# EAGLE schematic final (EAGLE 8.4.1)
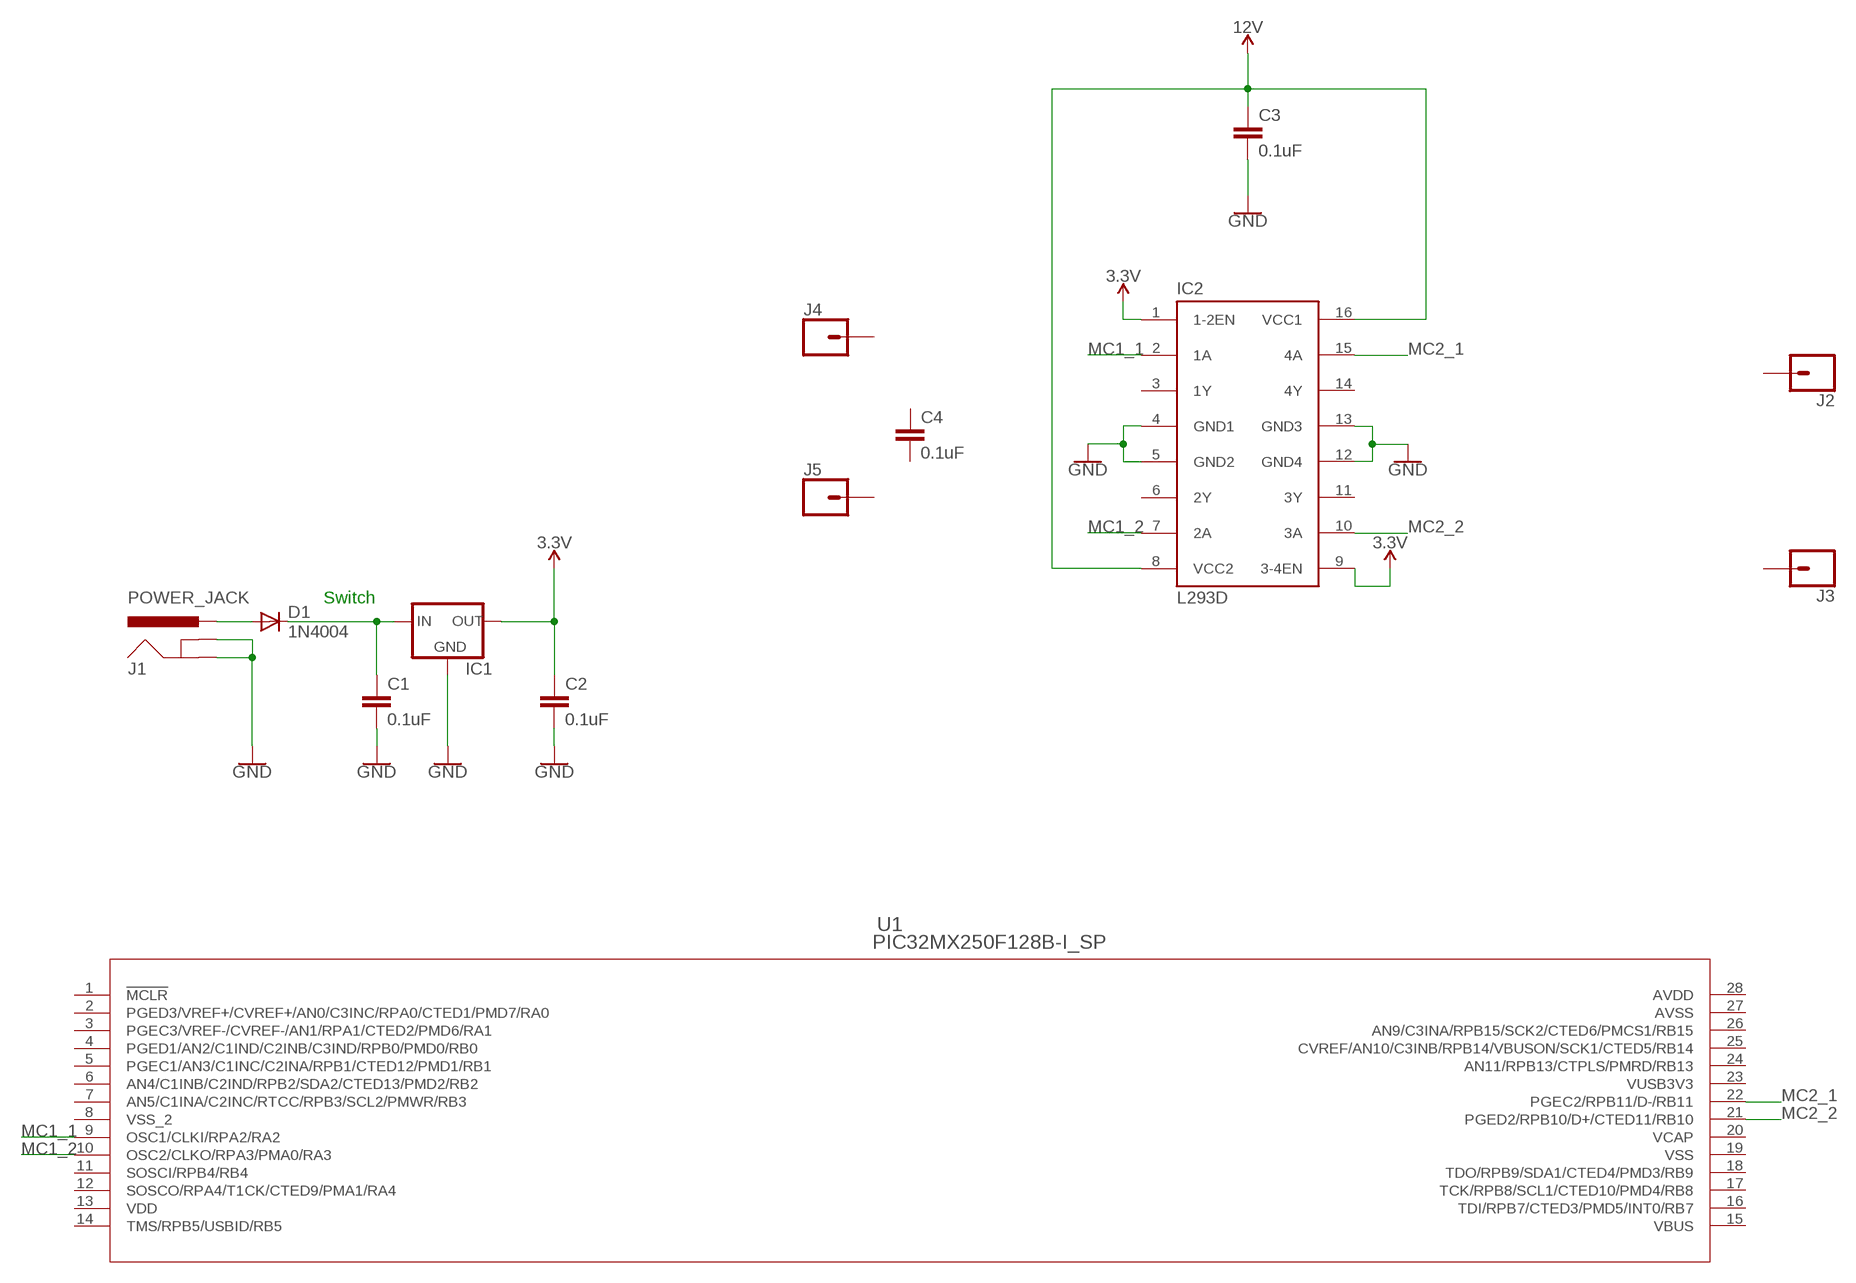
[diagram p0: schematic, sheet 1]

## Parts
C1  0.1uF  0.1UF-0402-16V-10%  [0402]
C2  0.1uF  0.1UF-0402-16V-10%  [0402]
C3  0.1uF  0.1UF-0402-16V-10%  [0402]
C4  0.1uF  0.1UF-0402-16V-10%  [0402]
D1  1N4004  [DO41-10]
IC1  MCP1700INLINE  [TO92-INLINE]
IC2  L293D  [DIL16]
J1  POWER_JACK  [POWER_JACK_PTH]
J2  CONN_01  [1X01]
J3  CONN_01  [1X01]
J4  CONN_01  [1X01]
J5  CONN_01  [1X01]
U1  PIC32MX250F128B-I_SP  [SPDIP28_300MC]

## Nets
3.3V: C2.1 IC1.3(OUT) IC2.1(1-2EN) IC2.9(3-4EN)
12V: C3.1 IC2.8(VCC2) IC2.16(VCC1)
GND: C1.2 C2.2 C3.2 IC1.1(GND) IC2.4(GND1) IC2.5(GND2) IC2.12(GND4) IC2.13(GND3) J1.GND J1.GNDBREAK
MC1_1: IC2.2(1A) U1.9(OSC1/CLKI/RPA2/RA2)
MC1_2: IC2.7(2A) U1.10(OSC2/CLKO/RPA3/PMA0/RA3)
MC2_1: IC2.15(4A) U1.22(PGEC2/RPB11/D-/RB11)
MC2_2: IC2.10(3A) U1.21(PGED2/RPB10/D+/CTED11/RB10)
N$1: D1.A J1.PWR
N$2: C1.1 D1.C IC1.2(IN)
Unconnected: C4.1 C4.2 IC2.3(1Y) IC2.6(2Y) IC2.11(3Y) IC2.14(4Y) J2.1 J3.1 J4.1 J5.1 U1.1(!MCLR) U1.2(PGED3/VREF+/CVREF+/AN0/C3INC/RPA0/CTED1/PMD7/RA0) U1.3(PGEC3/VREF-/CVREF-/AN1/RPA1/CTED2/PMD6/RA1) U1.4(PGED1/AN2/C1IND/C2INB/C3IND/RPB0/PMD0/RB0) U1.5(PGEC1/AN3/C1INC/C2INA/RPB1/CTED12/PMD1/RB1) U1.6(AN4/C1INB/C2IND/RPB2/SDA2/CTED13/PMD2/RB2) U1.7(AN5/C1INA/C2INC/RTCC/RPB3/SCL2/PMWR/RB3) U1.11(SOSCI/RPB4/RB4) U1.12(SOSCO/RPA4/T1CK/CTED9/PMA1/RA4) U1.14(TMS/RPB5/USBID/RB5) U1.16(TDI/RPB7/CTED3/PMD5/INT0/RB7) U1.17(TCK/RPB8/SCL1/CTED10/PMD4/RB8) U1.18(TDO/RPB9/SDA1/CTED4/PMD3/RB9) U1.24(AN11/RPB13/CTPLS/PMRD/RB13) U1.25(CVREF/AN10/C3INB/RPB14/VBUSON/SCK1/CTED5/RB14) U1.26(AN9/C3INA/RPB15/SCK2/CTED6/PMCS1/RB15)

## Notes on the sheet
- Switch

## Power pins joined to a net without a drawn wire
AVDD: U1.28(AVDD)
AVSS: U1.27(AVSS)
VBUS: U1.15(VBUS)
VCAP: U1.20(VCAP)
VDD: U1.13(VDD)
VSS: U1.19(VSS)
VSS_2: U1.8(VSS_2)
VUSB3V3: U1.23(VUSB3V3)

## Library data of the parts
C1-C4 = SparkFun-Capacitors:0.1UF: 0.1µF ceramic capacitors A capacitor is a passive two-terminal electrical component used to store electrical energy temporarily in an electric field.; PROD_ID: CAP-12416
D1 = diode:1N4004: DIODE general purpose rectifier, 1 A
IC1 = adafruit:MCP1700: VOLTAGE REGULATOR
IC2 = st-microelectronics:L293D: PUSH-PULL 4 CHANNEL DRIVER; MPN: L293D; OC_FARNELL: 9589619; OC_NEWARK: 56P8249
J1 = SparkFun-Connectors:POWER_JACK: Power Jack Connector This is the standard 5.5mm barrel jack for power. The PTH is the most common, proven, reliable, footprint. The Slot footprint only works if the mill layer is transmitted to the PCB fab house so be warned. Here are the connectors we sell at SparkFun: DC Barrel Power Jack/Connector <https://www.sparkfun.com/products/119> (PRT-00119) DC Barrel Power Jack/Connector (SMD) <https://www.sparkfun.com/products/12748> (PRT-12748) DC Barrel Jack Adapter - Breadboard Compatible <https://www.sparkfun.com/products/10811> (PRT-10811) It is used on this SparkFun product (and many, many others): SparkFun RedBoard - Programmed with Arduino <https://www.sparkfun.com/products/12757> (DEV-12757) Also, if you need a mating power supply or connector, please check these out: Wall Adapter Power Supply - 9VDC 650mA <https://www.sparkfun.com/products/298> (TOL-00298) DC Barrel Jack Adapter - Male <https://www.sparkfun.com/products/10287> (PRT-10287); PROD_ID: CONN-08197
J2-J5 = SparkFun-Connectors:CONN_01: Single connection point. Often used as Generic Header-pin footprint for 0.1 inch spaced/style header connections On any of the 0.1 inch spaced packages, you can populate with these: Break Away Headers - Straight <https://www.sparkfun.com/products/116> (PRT-00116) Break Away Male Headers - Right Angle <https://www.sparkfun.com/products/553> (PRT-00553) Female Headers <https://www.sparkfun.com/products/115> (PRT-00115) Break Away Headers - Machine Pin <https://www.sparkfun.com/products/117> (PRT-00117) Break Away Female Headers - Swiss Machine Pin <https://www.sparkfun.com/products/743> (PRT-00743) This device is also useful as a general connection point to wire up your design to another part of your project. Our various solder wires solder well into these plated through hole pads. Hook-Up Wire - Assortment (Stranded, 22 AWG) <https://www.sparkfun.com/products/11375> (PRT-11375) Hook-Up Wire - Assortment (Solid Core, 22 AWG) <https://www.sparkfun.com/products/11367> (PRT-11367) View the entire wire category on our website here <https://www.sparkfun.com/categories/141> Special notes: SMTSO-256-ET is a "flush mount" nut for a 4-40 screw. We mostly use this on specialty testbeds; it is a nice way to connect hardware to your PCB at an adjustable hieght. Also note, the SNAP packages are for using a snappable style connector. We sell a baggie of snaps and they are also used on two LilyPad designs: Snap Assortment - 30 pack (male and female) <https://www.sparkfun.com/products/11347> (DEV-11347) LilyPad Arduino SimpleSnap <https://www.sparkfun.com/products/10941> (DEV-10941) LilyPad SimpleSnap Protoboard <https://www.sparkfun.com/products/10940> (DEV-10940)
U1 = PIC32:PIC32MX250F128B-I_SP